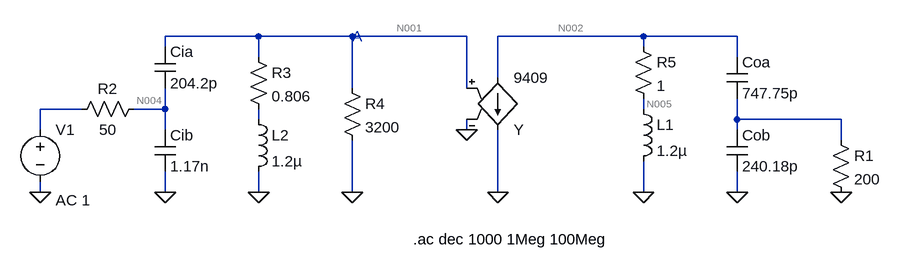
[diagram p0: schematic Sintonizado Simu (2da fecha 2024).asc]
Sintonizado Simu (2da fecha 2024).asc, the LTspice schematic file:
Version 4
SHEET 1 880 680
WIRE -272 48 -416 48
WIRE -128 48 -272 48
WIRE 48 48 -128 48
WIRE 320 48 96 48
WIRE 464 48 320 48
WIRE -416 64 -416 48
WIRE 320 64 320 48
WIRE -272 80 -272 48
WIRE 464 80 464 48
WIRE 96 112 96 48
WIRE -128 128 -128 48
WIRE 48 128 48 48
WIRE -544 160 -608 160
WIRE -416 160 -416 128
WIRE -416 160 -464 160
WIRE 320 160 320 144
WIRE -272 176 -272 160
WIRE 464 176 464 144
WIRE 624 176 464 176
WIRE -608 192 -608 160
WIRE -416 192 -416 160
WIRE 48 192 48 176
WIRE 464 192 464 176
WIRE 624 208 624 176
WIRE -608 288 -608 272
WIRE -416 288 -416 256
WIRE -272 288 -272 256
WIRE -128 288 -128 208
WIRE 96 288 96 192
WIRE 320 288 320 240
WIRE 464 288 464 256
FLAG 464 288 0
FLAG 624 288 0
FLAG 320 288 0
FLAG -272 288 0
FLAG -416 288 0
FLAG -608 288 0
FLAG 96 288 0
FLAG -128 288 0
FLAG 48 192 0
SYMBOL res 608 192 R0
SYMATTR InstName R1
SYMATTR Value 200
SYMBOL cap 448 192 R0
SYMATTR InstName Cob
SYMATTR Value 240.18p
SYMBOL cap 448 80 R0
SYMATTR InstName Coa
SYMATTR Value 747.75p
SYMBOL ind 304 144 R0
SYMATTR InstName L1
SYMATTR Value 1.2µ
SYMBOL res -448 144 R90
WINDOW 0 0 56 VBottom 2
WINDOW 3 32 56 VTop 2
SYMATTR InstName R2
SYMATTR Value 50
SYMBOL cap -432 64 R0
SYMATTR InstName Cia
SYMATTR Value 204.2p
SYMBOL cap -432 192 R0
SYMATTR InstName Cib
SYMATTR Value 1.17n
SYMBOL ind -288 160 R0
SYMATTR InstName L2
SYMATTR Value 1.2µ
SYMBOL voltage -608 176 R0
WINDOW 123 24 124 Left 2
WINDOW 39 0 0 Left 0
SYMATTR InstName V1
SYMATTR Value ""
SYMATTR Value2 AC 1
SYMBOL res -288 64 R0
SYMATTR InstName R3
SYMATTR Value 0.806
SYMBOL res -144 112 R0
SYMATTR InstName R4
SYMATTR Value 3200
SYMBOL g2 96 208 M180
SYMATTR InstName Y
SYMATTR Value 9409
SYMBOL res 304 48 R0
SYMATTR InstName R5
SYMATTR Value 1
TEXT -34 360 Left 2 !.ac dec 1000 1Meg 100Meg
TEXT -128 48 Left 2 ;A

The netlist it stands for:
* Sintonizado Simu (2da fecha 2024).asc
R1 N007 0 200
Cob N007 0 240.18p
Coa N002 N007 747.75p
L1 N005 0 1.2µ
R2 N004 N003 50
Cia N001 N004 204.2p
Cib N004 0 1.17n
L2 N006 0 1.2µ
V1 N003 0 AC 1
R3 N001 N006 0.806
R4 N001 0 3200
G§Y N002 0 N001 0 9409
R5 N002 N005 1
.ac dec 1000 1Meg 100Meg
* A
.backanno
.end

* Results of the author's LTspice run, read from the files saved beside the schematic
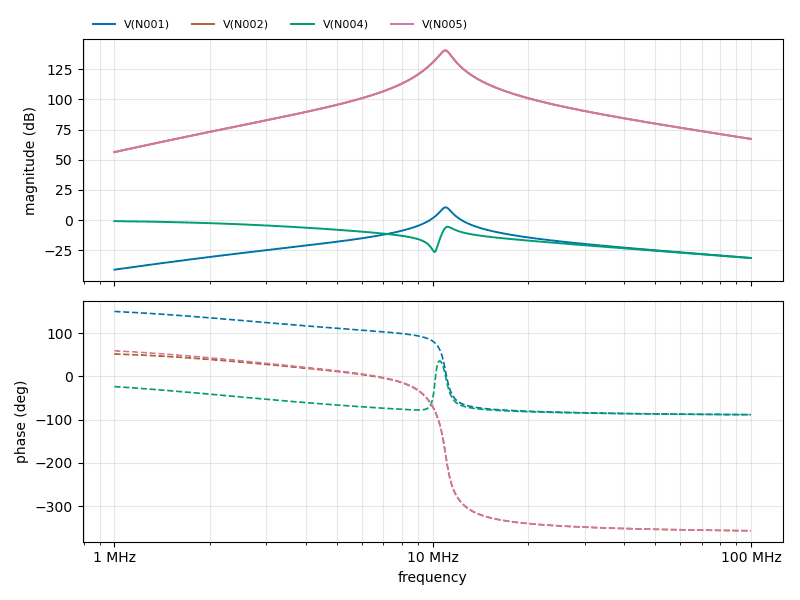
[diagram p1: AC Analysis of Sintonizado Simu (2da fecha 2024).asc, plotted from the saved traces]
* AC Analysis, 1 run:
*   V(N001): -40.90 dB at 1 MHz, -31.20 dB at 100 MHz, peak 10.65 dB at 10.99 MHz, 3 dB below the peak at 10.6 MHz and 11.38 MHz
*   V(N002): 56.34 dB at 1 MHz, 67.21 dB at 100 MHz, peak 140.39 dB at 10.96 MHz, 3 dB below the peak at 10.59 MHz and 11.32 MHz
*   V(N004): -0.74 dB at 1 MHz, -31.29 dB at 100 MHz, peak -0.74 dB at 1 MHz, 3 dB below the peak at 2.684 MHz
*   V(N005): 56.27 dB at 1 MHz, 67.21 dB at 100 MHz, peak 140.39 dB at 10.96 MHz, 3 dB below the peak at 10.59 MHz and 11.32 MHz